# Altium project bionik_wstep.PrjPcb
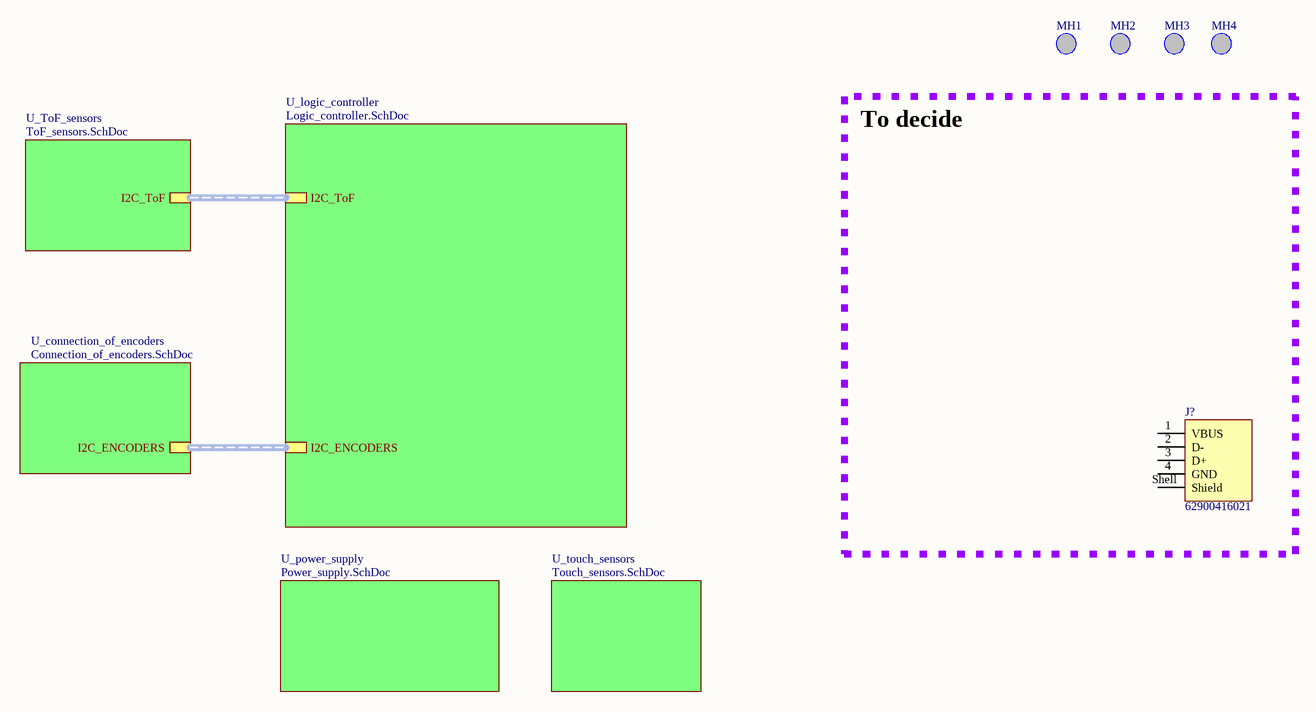
[diagram p0: Schield_elkapod.SchDoc]
6 sheets, 119 parts. Net scope: hierarchical (ports join the sheet entries above them; power ports are global).
Board file: PCB1.PcbDoc
Sheets:
  Schield_elkapod.SchDoc
    U_logic_controller = Logic_controller.SchDoc
    U_connection_of_encoders = Connection_of_encoders.SchDoc
    U_power_supply = Power_supply.SchDoc
    U_ToF_sensors = ToF_sensors.SchDoc
    U_touch_sensors = Touch_sensors.SchDoc

## Sheet Schield_elkapod.SchDoc
size A4; SheetNumber: 1; SheetTotal: 6

### Parts
(Parts that share a designator on the sheet are numbered #1, #2 ... from top to bottom, then left to right.)
J?#1  62900416021  [62900416021]
MH1  mounting hole  [MH?]  (value not drawn)
MH2  mounting hole  [MH?]  (value not drawn)
MH3  mounting hole  [MH?]  (value not drawn)
MH4  mounting hole  [MH?]  (value not drawn)

### Blocks framed on the sheet
To decide: J?#1

### Sub-sheets
U_connection_of_encoders = Connection_of_encoders.SchDoc: I2C_ENCODERS (harness I2C_MULTIPLEXERS)
U_logic_controller = Logic_controller.SchDoc: I2C_ENCODERS (harness I2C_MULTIPLEXERS), I2C_ToF
U_power_supply = Power_supply.SchDoc: no entries
U_ToF_sensors = ToF_sensors.SchDoc: I2C_ToF
U_touch_sensors = Touch_sensors.SchDoc: no entries

### Nets

Not connected (* = marked no-connect by the designer): J?#1 1(VBUS) 2(D-) 3(D+) 4(GND) Shell(Shield)

### Buses and harness runs
harness sheet U_connection_of_encoders/I2C_ENCODERS = sheet U_logic_controller/I2C_ENCODERS
harness sheet U_logic_controller/I2C_ToF = sheet U_ToF_sensors/I2C_ToF

### Library data of the parts
J?#1 = CMP-1502-03240-2: NexarPartId: 19991170; Number of Contacts: 4; Insulation Resistance: 1GΩ; Connector Type: USB; Contact Resistance: 20mΩ; Gender: Receptacle; Current Rating: 1.5A; Operating Supply Voltage: 30V; USB Standard: USB 2.0; Packaging: Cut Tape; Contact Plating: Gold; REACH SVHC: Unknown; Orientation: Horizontal; RoHS: Compliant; Features: Shielded; Length: 14.4mm; Max Operating Temperature: 105°C; Number of Pins: 4; Termination: SMD/SMT; Lead Free: Lead Free; Min Operating Temperature: -40°C; Mount: Horizontal, Surface Mount
MH1 = CMP-00030-00006-7: mounting hole 3mm padded
MH2 MH4 = CMP-00030-00006-7: Mmounting hole 3mm padded
MH3 = CMP-00030-00006-7: MHmounting hole 3mm padded

## Sheet Logic_controller.SchDoc
size A3; SheetNumber: 2; SheetTotal: 6
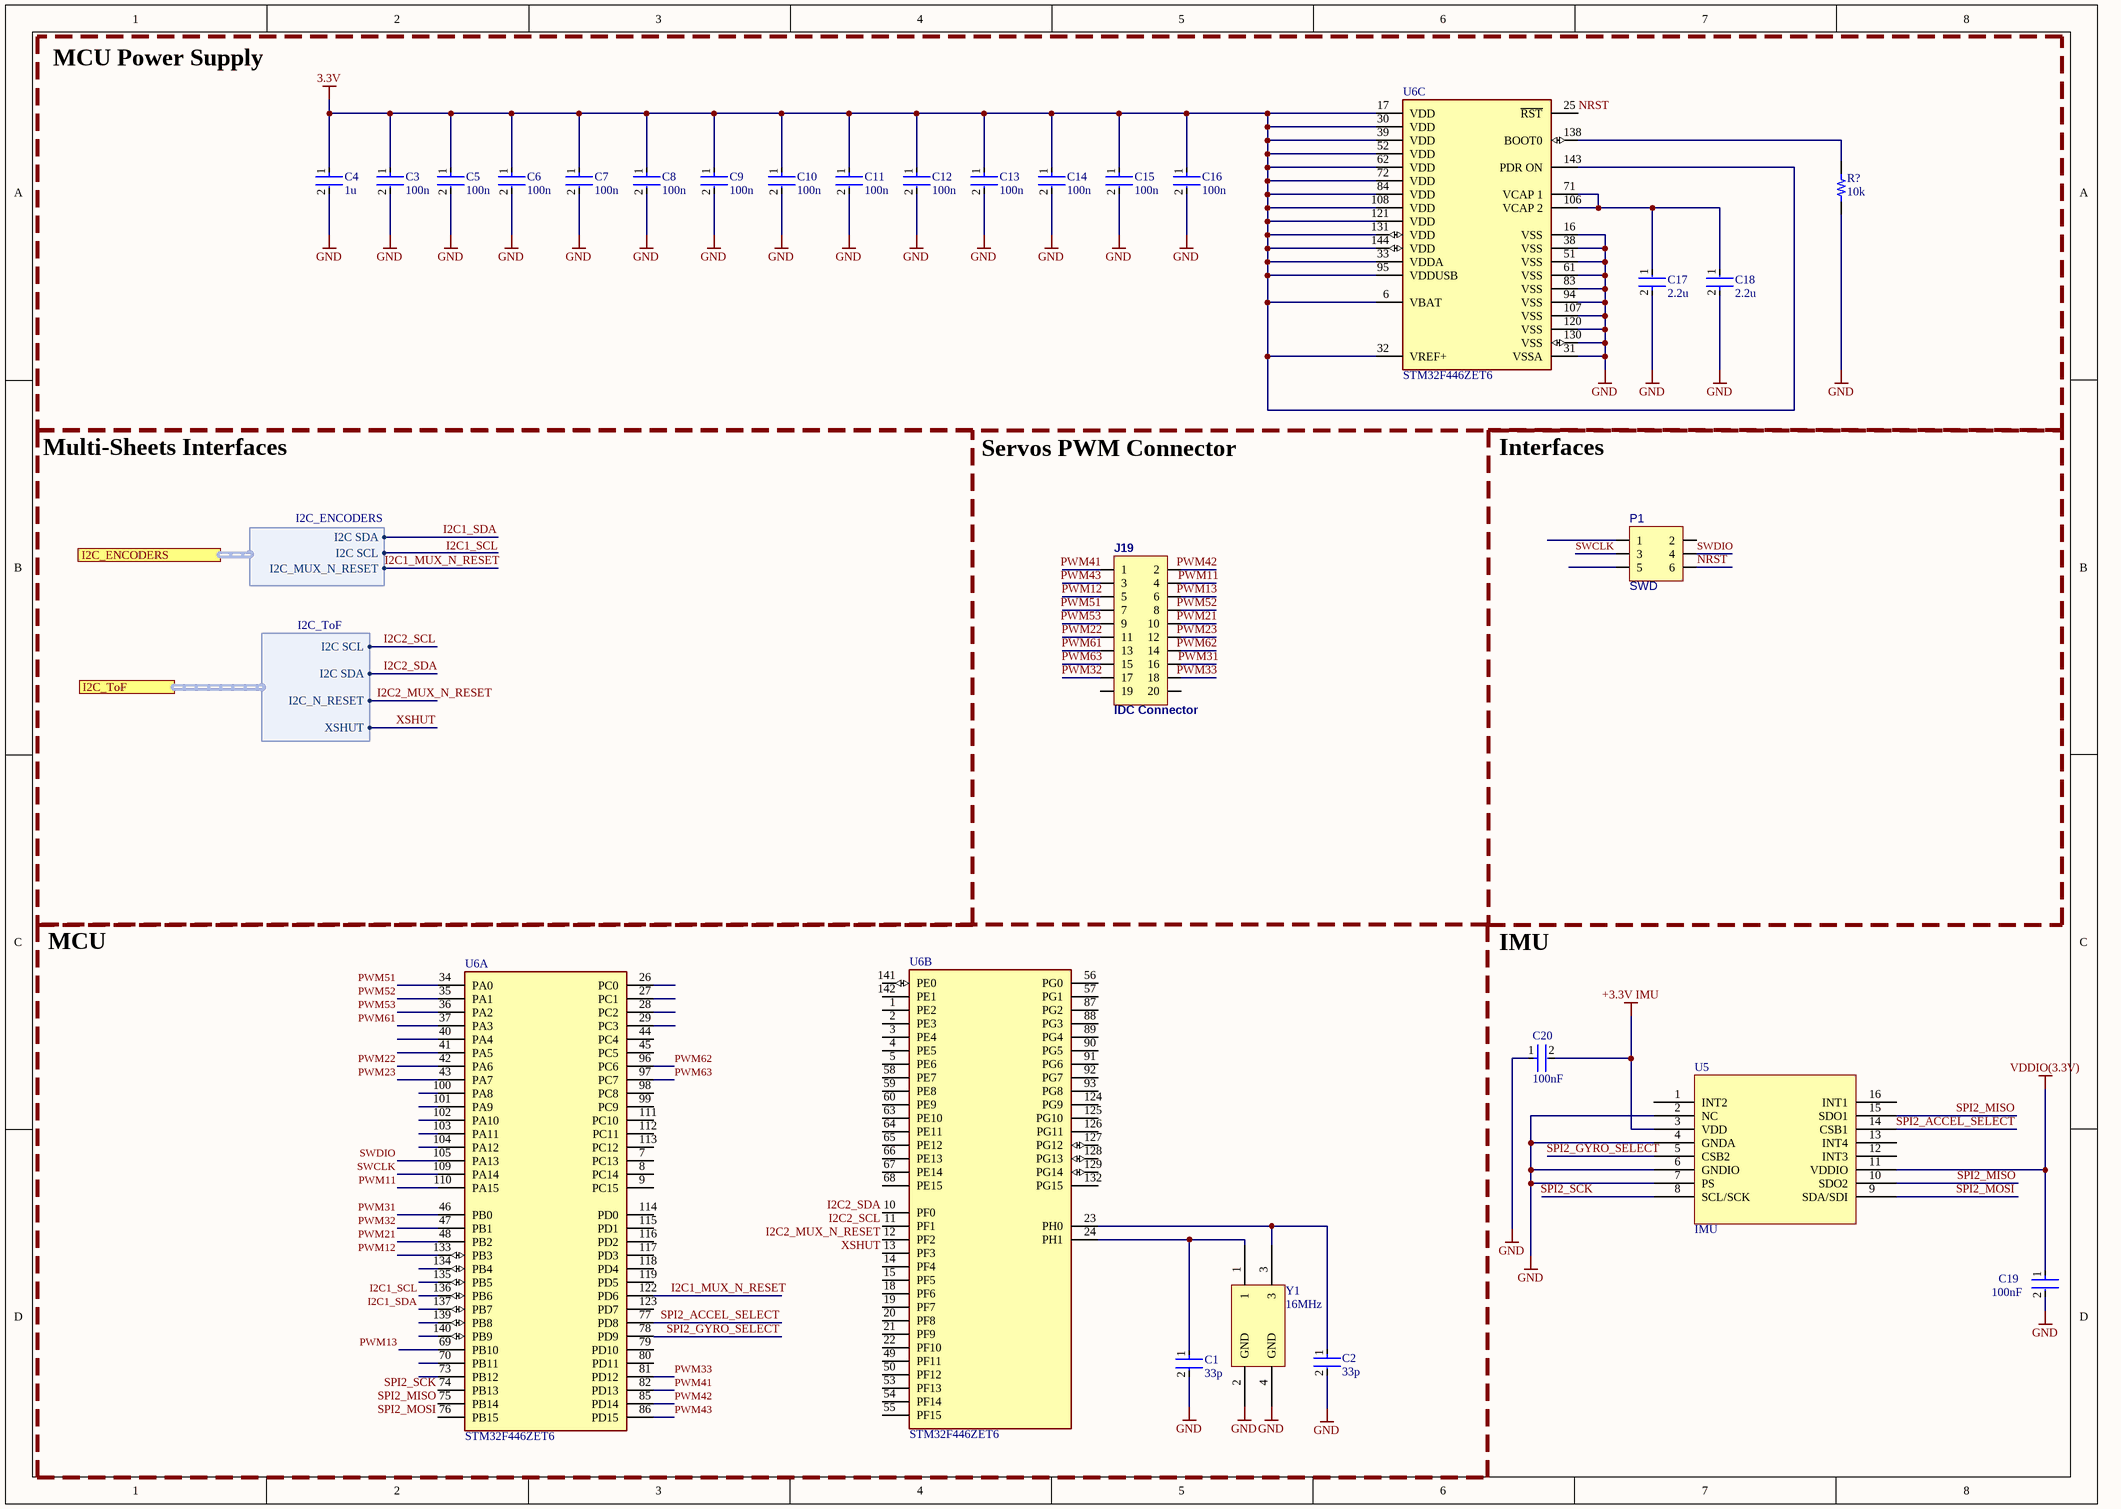
[diagram p1: Logic_controller.SchDoc]

### Parts
C1  33p  [FP-C0603C-CF-MFG]
C2  33p  [FP-C0603C-CF-MFG]
C3  100n  [FP-C0603C-CF-MFG]
C4  1u  [FP-C0603C-CF-MFG]
C5  100n  [FP-C0603C-CF-MFG]
C6  100n  [FP-C0603C-CF-MFG]
C7  100n  [FP-C0603C-CF-MFG]
C8  100n  [FP-C0603C-CF-MFG]
C9  100n  [FP-C0603C-CF-MFG]
C10  100n  [FP-C0603C-CF-MFG]
C11  100n  [FP-C0603C-CF-MFG]
C12  100n  [FP-C0603C-CF-MFG]
C13  100n  [FP-C0603C-CF-MFG]
C14  100n  [FP-C0603C-CF-MFG]
C15  100n  [FP-C0603C-CF-MFG]
C16  100n  [FP-C0603C-CF-MFG]
C17  2.2u  [FP-C1608-080-0_1-MFG]
C18  2.2u  [FP-C1608-080-0_1-MFG]
C19  100nF  [FP-CC0603-DA-MFG]
C20  100nF  [FP-CC0603-DA-MFG]
J19  IDC Connector  [IDC20]
P1  SWD  [GP_3x2]
R?  10k  [RES 0603_1608]
U5  IMU  [BMI088-Footprint-1]
U6  STM32F446ZET6  [FP-STM32F446ZET6-IPC_C]  (parts A,B,C of 3)
Y1  16MHz  [New footprint 1]

### Blocks framed on the sheet
MCU Power Supply: C3-C18 R? U6
Interfaces: P1
MCU: C1 C2 U6 Y1

### Ports
I2C_ENCODERS (harness I2C_ENCODERS, see Schield_elkapod[2B], Connection_of_encoders[1A]), I2C_ToF (harness I2C_ToF, see Schield_elkapod[2A], ToF_sensors[1A])

### Harnesses
I2C_ENCODERS: I2C SDA, I2C SCL, I2C_MUX_N_RESET
I2C_ToF: I2C SCL, I2C SDA, I2C_N_RESET, XSHUT

### Nets
3.3V: C3.1 C4.1 C5.1 C6.1 C7.1 C8.1 C9.1 C10.1 C11.1 C12.1 C13.1 C14.1 C15.1 C16.1 U6.6(VBAT) U6.17(VDD) U6.30(VDD) U6.32(VREF+) U6.33(VDDA) U6.39(VDD) U6.52(VDD) U6.62(VDD) U6.72(VDD) U6.84(VDD) U6.95(VDDUSB) U6.108(VDD) U6.121(VDD) U6.131(VDD) U6.143(PDR_ON) U6.144(VDD)
+3.3V IMU: C20.2 U5.3(VDD)
GND: C1.2 C2.2 C3.2 C4.2 C5.2 C6.2 C7.2 C8.2 C9.2 C10.2 C11.2 C12.2 C13.2 C14.2 C15.2 C16.2 C17.2 C18.2 C19.2 C20.1 R?.2 U5.2(NC) U5.4(GNDA) U5.6(GNDIO) U5.7(PS) U6.16(VSS) U6.31(VSSA) U6.38(VSS) U6.51(VSS) U6.61(VSS) U6.83(VSS) U6.94(VSS) U6.107(VSS) U6.120(VSS) U6.130(VSS) Y1.2(GND) Y1.4(GND)
VDDIO(3.3V): C19.1 U5.11(VDDIO)
I2C1_MUX_N_RESET: U6.122(PD6) ; port I2C_ENCODERS.I2C_MUX_N_RESET
I2C1_SCL: U6.136(PB6) ; port I2C_ENCODERS.I2C SCL
I2C1_SDA: U6.137(PB7) ; port I2C_ENCODERS.I2C SDA
I2C2_MUX_N_RESET: U6.12(PF2) ; port I2C_ToF.I2C_N_RESET
I2C2_SCL: U6.11(PF1) ; port I2C_ToF.I2C SCL
I2C2_SDA: U6.10(PF0) ; port I2C_ToF.I2C SDA
NRST: P1.6 U6.25(~{RST})
PWM11: J19.4 U6.110(PA15)
PWM12: J19.5 U6.133(PB3)
PWM13: J19.6 U6.69(PB10)
PWM21: J19.10 U6.48(PB2)
PWM22: J19.11 U6.42(PA6)
PWM23: J19.12 U6.43(PA7)
PWM31: J19.16 U6.46(PB0)
PWM32: J19.17 U6.47(PB1)
PWM33: J19.18 U6.81(PD12)
PWM41: J19.1 U6.82(PD13)
PWM42: J19.2 U6.85(PD14)
PWM43: J19.3 U6.86(PD15)
PWM51: J19.7 U6.34(PA0)
PWM52: J19.8 U6.35(PA1)
PWM53: J19.9 U6.36(PA2)
PWM61: J19.13 U6.37(PA3)
PWM62: J19.14 U6.96(PC6)
PWM63: J19.15 U6.97(PC7)
SPI2_ACCEL_SELECT: U5.14(CSB1) U6.77(PD8)
SPI2_GYRO_SELECT: U5.5(CSB2) U6.78(PD9)
SPI2_MISO: U5.10(SDO2) U5.15(SDO1) U6.75(PB14)
SPI2_MOSI: U5.9(SDA/SDI) U6.76(PB15)
SPI2_SCK: U5.8(SCL/SCK) U6.74(PB13)
SWCLK: P1.3 U6.109(PA14)
SWDIO: P1.4 U6.105(PA13)
XSHUT: U6.13(PF3) ; port I2C_ToF.XSHUT
NetC1_1: C1.1 U6.24(PH1) Y1.1
NetC2_1: C2.1 U6.23(PH0) Y1.3
NetC17_1: C17.1 C18.1 U6.71(VCAP_1) U6.106(VCAP_2)
NetR?_1: R?.1 U6.138(BOOT0)

Not connected (* = marked no-connect by the designer): J19 19 20; P1 1 2 5; U5 1(INT2) 12(INT3) 13(INT4) 16(INT1); U6 1(PE2) 2(PE3) 3(PE4) 4(PE5) 5(PE6) 7(PC13) 8(PC14) 9(PC15) 14(PF4) 15(PF5) 18(PF6) 19(PF7) 20(PF8) 21(PF9) 22(PF10) 26(PC0) 27(PC1) 28(PC2) 29(PC3) 40(PA4) 41(PA5) 44(PC4) 45(PC5) 49(PF11) 50(PF12) 53(PF13) 54(PF14) 55(PF15) 56(PG0) 57(PG1) 58(PE7) 59(PE8) 60(PE9) 63(PE10) 64(PE11) 65(PE12) 66(PE13) 67(PE14) 68(PE15) 70(PB11) 73(PB12) 79(PD10) 80(PD11) 87(PG2) 88(PG3) 89(PG4) 90(PG5) 91(PG6) 92(PG7) 93(PG8) 98(PC8) 99(PC9) 100(PA8) 101(PA9) 102(PA10) 103(PA11) 104(PA12) 111(PC10) 112(PC11) 113(PC12) 114(PD0) 115(PD1) 116(PD2) 117(PD3) 118(PD4) 119(PD5) 123(PD7) 124(PG9) 125(PG10) 126(PG11) 127(PG12) 128(PG13) 129(PG14) 132(PG15) 134(PB4) 135(PB5) 139(PB8) 140(PB9) 141(PE0) 142(PE1)

### Notes on the sheet
- Multi-Sheets Interfaces
- Servos PWM Connector
- IMU

### Library data of the parts
C1 C2 = CMP-03020-030291-1: Cap Ceramic 0.0027uF 25V C0G 1% SMD 0603 125°C Paper T/R; Manufacturer: KEMET; Manufacturer Part Number: C0603C272F3GAC7867; Automotive Grade: Grade 1; Tolerance: 0.01; Value: 2,700 pF; Temperature Coefficient: 30ppm/°C; Material: Ceramic; Device Class L2: Capacitors; Device Class L3: Ceramic Capacitors; ComponentLink2Description: Datasheet; Category: Cap; Automotive: Yes; Octopart: https://octopart.com/c0603c272f3gac7867-kemet-90390867; Temperature Range High: +125°C; Package: C0603C-CF; Device Class L1: Passive Components; Digikey Description: Cap Ceramic 0.0027uF 25V C0G 1% SMD 0603 125°C Paper T/R; Temperature Characteristic: C0G; Temperature Range Low: -55°C; Temperature: -55°C to +125°C; Height: 0.87mm; ComponentLink2URL: https://api.kemet.com/component-edge/download/datasheet/C0603C100J5GACAUTO.pdf; Voltage Rating: 25 V; Capacitance: 2,700 pF; Lead Free: Yes; RoHS: TRUE
C3 C5-C16 = CMP-03020-030291-1: CAP CER 100nF 25V X5R 0603 C0603C272F3GAC7867; Manufacturer: KEMET; Material: Ceramic; Automotive Grade: Grade 1; Tolerance: 0.01; Temperature Characteristic: C0G; Value: 2,700 pF; Temperature Coefficient: 30ppm/°C; Device Class L2: Capacitors; Device Class L3: Ceramic Capacitors; ComponentLink2Description: Datasheet; Category: Cap; Automotive: Yes; Octopart: https://octopart.com/c0603c272f3gac7867-kemet-90390867; Temperature Range High: +125°C; Package: C0603C-CF; Device Class L1: Passive Components; Digikey Description: Cap Ceramic 0.0027uF 25V C0G 1% SMD 0603 125°C Paper T/R; Temperature Range Low: -55°C; Temperature: -55°C to +125°C; Height: 0.87mm; ComponentLink2URL: https://api.kemet.com/component-edge/download/datasheet/C0603C100J5GACAUTO.pdf; Voltage Rating: 25 V; Capacitance: 2,700 pF; Lead Free: Yes; Manufacturer Part Number: C0603C272F3GAC7867; RoHS: TRUE
C4 = CMP-03020-030291-1: CAP CER 1uF 16V X5R 0603 C0603C272F3GAC7867; Manufacturer: KEMET; Material: Ceramic; Automotive Grade: Grade 1; Tolerance: 0.01; Temperature Characteristic: C0G; Value: 2,700 pF; Voltage Rating: 25 V; Temperature Coefficient: 30ppm/°C; Device Class L2: Capacitors; Device Class L3: Ceramic Capacitors; ComponentLink2Description: Datasheet; Category: Cap; Automotive: Yes; Octopart: https://octopart.com/c0603c272f3gac7867-kemet-90390867; Temperature Range High: +125°C; Package: C0603C-CF; Device Class L1: Passive Components; Digikey Description: Cap Ceramic 0.0027uF 25V C0G 1% SMD 0603 125°C Paper T/R; Temperature Range Low: -55°C; Temperature: -55°C to +125°C; Height: 0.87mm; ComponentLink2URL: https://api.kemet.com/component-edge/download/datasheet/C0603C100J5GACAUTO.pdf; Capacitance: 2,700 pF; Lead Free: Yes; Manufacturer Part Number: C0603C272F3GAC7867; RoHS: TRUE
C17 C18 = CMP-08246-003049-1: Multilayer Ceramic Capacitors 2.2μF ±10% 25V X5R SMD 0603 C1608X5R1E225K080AB; Capacitance: 2.2uF; Termination: SMD/SMT; Dielectric Material: Ceramic; REACH SVHC: No SVHC; Voltage Rating (DC): 25V; Voltage Rating: 25V; RoHS Compliant: Yes; Case Code (Imperial): 0603; Case/Package: 0603; Height: 0.8mm; Mount: Surface Mount; Min Operating Temperature: -55°C; Tolerance: 10%; Radiation Hardening: No; Dielectric: X5R; Depth: 0.8mm; Package Quantity: 4000; Length: 1.6mm; Weight: 7.1E-05oz; Resistor Type: Ceramic; Series: C; Thickness: 0.035inch; Width: 0.031inch; Case Code (Metric): 1608; Lead Free: Lead Free; Max Operating Temperature: 85°C; Packaging: Tape and Reel
C19 C20 = CMP-2100-03601-2: CAP CER 0.1UF 50V X7R 0603 CC0603KRX7R9BB104; Manufacturer: YAGEO; Material: Ceramic; Temperature Coefficient: 15%; Tolerance: 0.1; Height: 0.9mm; Voltage: 50 V; ComponentLink2Description: Datasheet; Device Class L2: Capacitors; Temperature Range High: +125°C; Category: Cap; Capacitance: 100 nF; Footprint Url: http://www.yageo.com/exep/pages/download/literatures/UPY-C_GEN_24.pdf; ComponentLink2URL: http://www.yageo.com/documents/recent/UPY-GPHC_X7R_6.3V-to-50V_18.pdf; Package: CC0603-DA; Temperature: -55°C to +125°C; Voltage Rating: 50 V; Temperature Characteristic: X7R; Device Class L1: Passive Components; Temperature Range Low: -55°C; Manufacturer Part Number: CC0603KRX7R9BB104; RoHS: TRUE; Automotive: No; Value: 100 nF; Device Class L3: Ceramic Capacitors; Octopart: https://octopart.com/cc0603krx7r9bb104-yageo-42244635; Mouser Description: Multilayer Ceramic Capacitor, CC Series, 0.1 - F, - 10%, X7R, 50 V, 0603 [1608 Metric]; Lead Free: Yes; Digikey Description: CAP CER 0.1UF 50V X7R 0603
J19 = CN_10x2
P1 = CN_3x2
R? = RNCS0603BKE10K0: RES 10K OHM 1% 0,1W 0603; Manufacturer: Stackpole Electronics Inc; Power (Watts): 0.063W, 1/16W; Temperature Coefficient: ±25ppm/°C; Tolerance: ±0.1%; Part Number: RNCS0603BKE10K0; Value: 10k; Composition: Thin Film; Device Package: 0603 (1608 Metric); Features: Anti-Corrosive, Automotive AEC-Q200, Moisture Resistant; Height - Seated (Max): 0.022" (0.55mm); LastUpdated: 09.02.2024 20:43:37; Lifecycle Status: Active; Minimum Order: 1; Number of Terminations: 2; Operating Temperature: -55°C ~ 155°C; Package / Case: 0603 (1608 Metric); Packaging: TapeAndReel; PartId: 4838; Part Status: Active; Price: 0.06; Ratings: AEC-Q200; Resistance: 10k; Series: RNCS; Size / Dimension: 0.061" L x 0.031" W (1.55mm x 0.80mm); Supplier Device Package: 0603
U5 = CMP-00030-00005-6: BMI088 Series 3.6 V 6 Axis Digital Output Accelerometer Motion Sensor - LGA-16
U6 = CMP-12105-000067-1: IC MCU 32BIT 512KB FLASH 144LQFP; Manufacturer: STMicroelectronics; Standoff Height: 0.05mm; Memory Size: 512KBytes; Data Bus Width: 32bits; Number Of Timers/Counters: 14; Number Of I2C Channels: 4; Number Of Usb Channels: 2; Frequency: 180MHz; Ram Size: 128KBytes; Number Of I/Os: 114; Min Supply Voltage: 1.7V; Max Junction Temp: +105°C; Number Of Cores: 1; Core Architecture: Arm Cortex-M4; Max Supply Voltage: 3.6V; Number Of Adc Channels: 24; Number Of Pwm Channels: 32; Number Of Uart Channels: 6; Number Of A/D Converters: 3; Interface: I2C,SPI,UART,USART,EBI/EMI,CAN,USB,LIN,IrDA,I2S,SMBus,Other; Mouser Description: 32 Bit Microcontroller, High Performance, Arm Cortex-M4, 180 Mhz, 512 Kb, 128 Kb, 144, Lqfp; Temperature Range High: +105°C; Device Class L3: Microcontrollers; Ambient Temperature Range High: +85°C; Lead Free: Yes; Octopart: https://octopart.com/stm32f446zet6-stmicroelectronics-52642927; Device Class L2: Embedded Processors and Controllers; Height: 1.6mm; Category: IC; Manufacturer Part Number: STM32F446ZET6; RoHS: TRUE; Memory Type: FLASH; Temperature: -40°C to +105°C; Number Of Spi Channels: 4; Device Class L1: Integrated Circuits (ICs); Package: LQFP144; Digikey Description: IC MCU 32BIT 512KB FLASH 144LQFP; Automotive: No; ComponentLink2Description: Datasheet; ComponentLink2URL: https://www.st.com/content/ccc/resource/technical/document/datasheet/65/cb/75/50/53/d6/48/24/DM00141306.pdf/files/DM00141306.pdf/jcr:content/translations/en.DM00141306.pdf; Ambient Temperature Range Low: -40°C; Temperature Range Low: -40°C
Y1 = CMP-00030-00007-3: resonator 16MHz LFXTAL030819BULK

## Sheet Connection_of_encoders.SchDoc
size A4; SheetNumber: 3; SheetTotal: 6
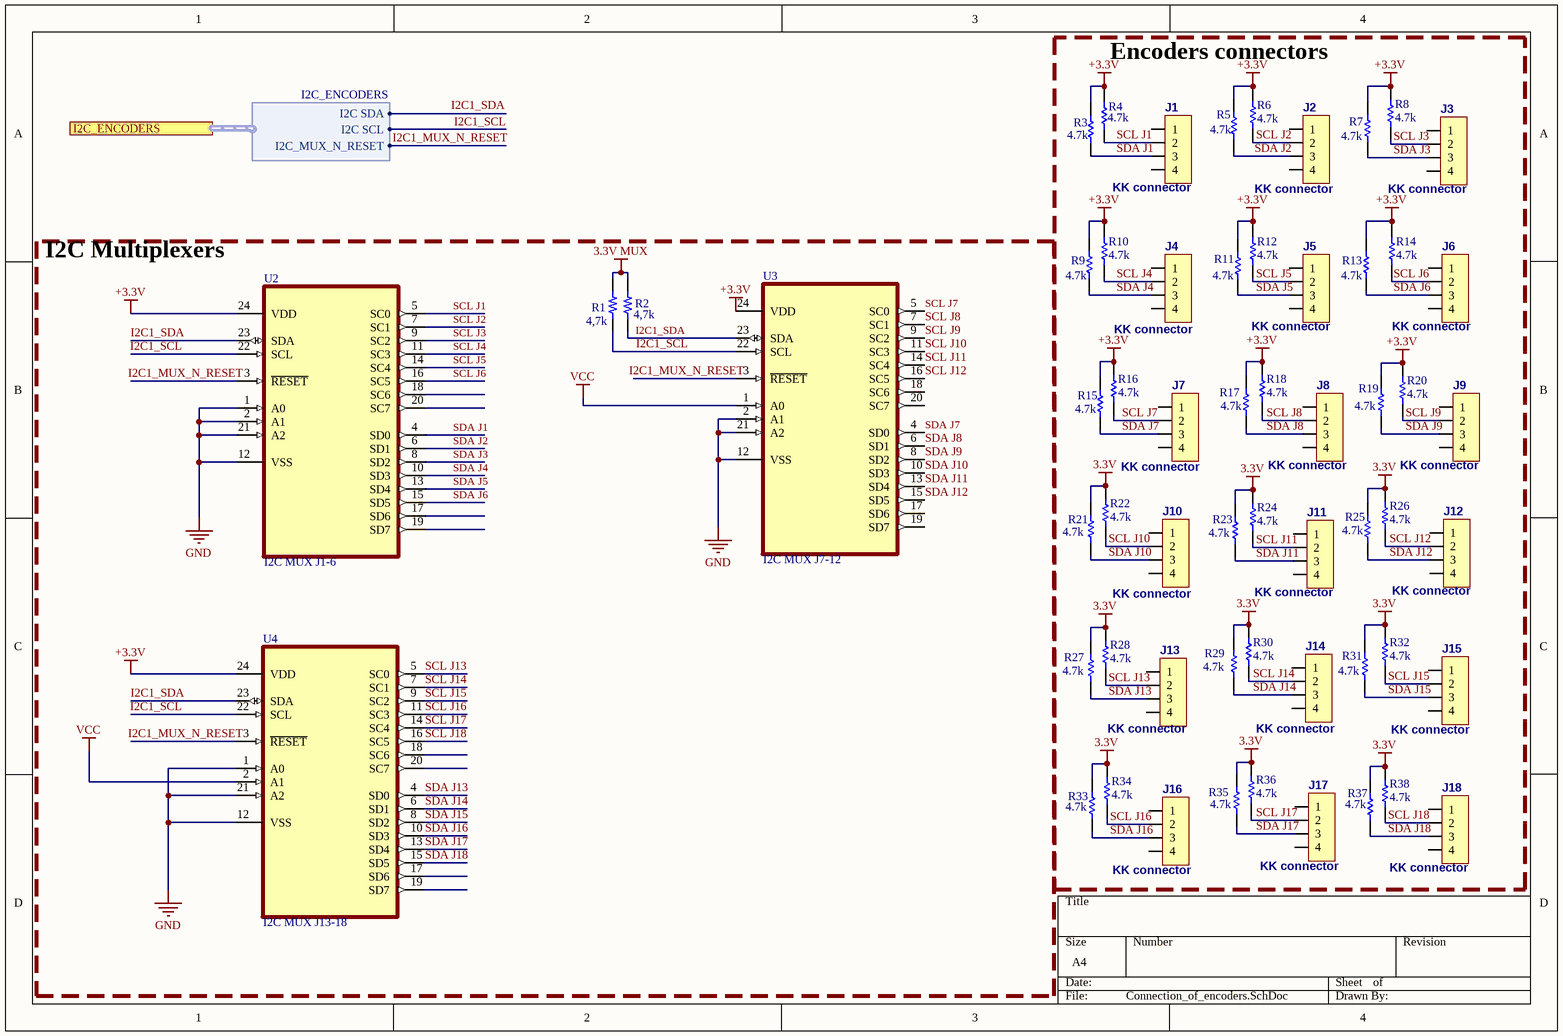
[diagram p2: Connection_of_encoders.SchDoc]

### Parts
J1  KK connector  [KK/2.54/4]
J2  KK connector  [KK/2.54/4]
J3  KK connector  [KK/2.54/4]
J4  KK connector  [KK/2.54/4]
J5  KK connector  [KK/2.54/4]
J6  KK connector  [KK/2.54/4]
J7  KK connector  [KK/2.54/4]
J8  KK connector  [KK/2.54/4]
J9  KK connector  [KK/2.54/4]
J10  KK connector  [KK/2.54/4]
J11  KK connector  [KK/2.54/4]
J12  KK connector  [KK/2.54/4]
J13  KK connector  [KK/2.54/4]
J14  KK connector  [KK/2.54/4]
J15  KK connector  [KK/2.54/4]
J16  KK connector  [KK/2.54/4]
J17  KK connector  [KK/2.54/4]
J18  KK connector  [KK/2.54/4]
R1  4,7k  [RES 0603_1608]
R2  4,7k  [RES 0603_1608]
R3  4.7k  [RESC1609X50X30ML10T20]
R4  4.7k  [RESC1609X50X30ML10T20]
R5  4.7k  [RESC1609X50X30ML10T20]
R6  4.7k  [RESC1609X50X30ML10T20]
R7  4.7k  [RESC1609X50X30ML10T20]
R8  4.7k  [RESC1609X50X30ML10T20]
R9  4.7k  [RESC1609X50X30ML10T20]
R10  4.7k  [RESC1609X50X30ML10T20]
R11  4.7k  [RESC1609X50X30ML10T20]
R12  4.7k  [RESC1609X50X30ML10T20]
R13  4.7k  [RESC1609X50X30ML10T20]
R14  4.7k  [RESC1609X50X30ML10T20]
R15  4.7k  [RESC1609X50X30ML10T20]
R16  4.7k  [RESC1609X50X30ML10T20]
R17  4.7k  [RESC1609X50X30ML10T20]
R18  4.7k  [RESC1609X50X30ML10T20]
R19  4.7k  [RESC1609X50X30ML10T20]
R20  4.7k  [RESC1609X50X30ML10T20]
R21  4.7k  [RESC1609X50X30ML10T20]
R22  4.7k  [RESC1609X50X30ML10T20]
R23  4.7k  [RESC1609X50X30ML10T20]
R24  4.7k  [RESC1609X50X30ML10T20]
R25  4.7k  [RESC1609X50X30ML10T20]
R26  4.7k  [RESC1609X50X30ML10T20]
R27  4.7k  [RESC1609X50X30ML10T20]
R28  4.7k  [RESC1609X50X30ML10T20]
R29  4.7k  [RESC1609X50X30ML10T20]
R30  4.7k  [RESC1609X50X30ML10T20]
R31  4.7k  [RESC1609X50X30ML10T20]
R32  4.7k  [RESC1609X50X30ML10T20]
R33  4.7k  [RESC1609X50X30ML10T20]
R34  4.7k  [RESC1609X50X30ML10T20]
R35  4.7k  [RESC1609X50X30ML10T20]
R36  4.7k  [RESC1609X50X30ML10T20]
R37  4.7k  [RESC1609X50X30ML10T20]
R38  4.7k  [RESC1609X50X30ML10T20]
U2  I2C MUX J1-6  [SOP65P640X110-24N]
U3  I2C MUX J7-12  [SOP65P640X110-24N]
U4  I2C MUX J13-18  [SOP65P640X110-24N]

### Blocks framed on the sheet
Encoders connectors: J1-J18 R3-R38
I2C Multiplexers: R1 R2 U2-U4

### Ports
I2C_ENCODERS (harness I2C_ENCODERS, see Schield_elkapod[2B], Logic_controller[1B])

### Harnesses
I2C_ENCODERS: I2C SDA, I2C SCL, I2C_MUX_N_RESET

### Nets
3.3V: R21.2 R22.2 R23.2 R24.2 R25.2 R26.2 R27.2 R28.2 R29.2 R30.2 R31.2 R32.2 R33.2 R34.2 R35.2 R36.2 R37.2 R38.2
3.3V MUX: R1.1 R2.1
+3.3V: R3.2 R4.2 R5.2 R6.2 R7.2 R8.2 R9.2 R10.2 R11.2 R12.2 R13.2 R14.2 R15.2 R16.2 R17.2 R18.2 R19.2 R20.2 U2.24(VDD) U3.24(VDD) U4.24(VDD)
GND: U2.1(A0) U2.2(A1) U2.12(VSS) U2.21(A2) U3.2(A1) U3.12(VSS) U3.21(A2) U4.1(A0) U4.12(VSS) U4.21(A2)
VCC: U3.1(A0) U4.2(A1)
I2C1_MUX_N_RESET: U2.3(~{RESET}) U3.3(~{RESET}) U4.3(~{RESET}) ; port I2C_ENCODERS.I2C_MUX_N_RESET
I2C1_SCL: R1.2 U2.22(SCL) U3.22(SCL) U4.22(SCL) ; port I2C_ENCODERS.I2C SCL
I2C1_SDA: R2.2 U2.23(SDA) U3.23(SDA) U4.23(SDA) ; port I2C_ENCODERS.I2C SDA
SCL J1: J1.2 R4.1 U2.5(SC0)
SCL J2: J2.2 R6.1 U2.7(SC1)
SCL J3: J3.2 R8.1 U2.9(SC2)
SCL J4: J4.2 R10.1 U2.11(SC3)
SCL J5: J5.2 R12.1 U2.14(SC4)
SCL J6: J6.2 R14.1 U2.16(SC5)
SCL J7: J7.2 R16.1 U3.5(SC0)
SCL J8: J8.2 R18.1 U3.7(SC1)
SCL J9: J9.2 R20.1 U3.9(SC2)
SCL J10: J10.2 R22.1 U3.11(SC3)
SCL J11: J11.2 R24.1 U3.14(SC4)
SCL J12: J12.2 R26.1 U3.16(SC5)
SCL J13: J13.2 R28.1 U4.5(SC0)
SCL J14: J14.2 R30.1 U4.7(SC1)
SCL J15: J15.2 R32.1 U4.9(SC2)
SCL J16: J16.2 R34.1 U4.11(SC3)
SCL J17: J17.2 R36.1 U4.14(SC4)
SCL J18: J18.2 R38.1 U4.16(SC5)
SDA J1: J1.3 R3.1 U2.4(SD0)
SDA J2: J2.3 R5.1 U2.6(SD1)
SDA J3: J3.3 R7.1 U2.8(SD2)
SDA J4: J4.3 R9.1 U2.10(SD3)
SDA J5: J5.3 R11.1 U2.13(SD4)
SDA J6: J6.3 R13.1 U2.15(SD5)
SDA J7: J7.3 R15.1 U3.4(SD0)
SDA J8: J8.3 R17.1 U3.6(SD1)
SDA J9: J9.3 R19.1 U3.8(SD2)
SDA J10: J10.3 R21.1 U3.10(SD3)
SDA J11: J11.3 R23.1 U3.13(SD4)
SDA J12: J12.3 R25.1 U3.15(SD5)
SDA J13: J13.3 R27.1 U4.4(SD0)
SDA J14: J14.3 R29.1 U4.6(SD1)
SDA J15: J15.3 R31.1 U4.8(SD2)
SDA J16: J16.3 R33.1 U4.10(SD3)
SDA J17: J17.3 R35.1 U4.13(SD4)
SDA J18: J18.3 R37.1 U4.15(SD5)

Not connected (* = marked no-connect by the designer): J1 1 4; J2 1 4; J3 1 4; J4 1 4; J5 1 4; J6 1 4; J7 1 4; J8 1 4; J9 1 4; J10 1 4; J11 1 4; J12 1 4; J13 1 4; J14 1 4; J15 1 4; J16 1 4; J17 1 4; J18 1 4; U2 17(SD6) 18(SC6) 19(SD7) 20(SC7); U3 17(SD6) 18(SC6) 19(SD7) 20(SC7); U4 17(SD6) 18(SC6) 19(SD7) 20(SC7)

### Library data of the parts
J1-J18 = CN_4x1: Connector: PCB-cable; KK; socket; male; PIN:4; straight/right-angle; tinned; THT
R1 R2 = RNCS0603BKE10K0: RES 4,7K OHM 1% 0,1W 0603; Manufacturer: Stackpole Electronics Inc; Power (Watts): 0.063W, 1/16W; Temperature Coefficient: ±25ppm/°C; Tolerance: ±0.1%; Part Number: RNCS0603BKE10K0; Value: 4,7k; Composition: Thin Film; Device Package: 0603 (1608 Metric); Features: Anti-Corrosive, Automotive AEC-Q200, Moisture Resistant; Height - Seated (Max): 0.022" (0.55mm); LastUpdated: 09.02.2024 20:43:37; Lifecycle Status: Active; Minimum Order: 1; Number of Terminations: 2; Operating Temperature: -55°C ~ 155°C; Package / Case: 0603 (1608 Metric); Packaging: TapeAndReel; PartId: 4838; Part Status: Active; Price: 0.06; Ratings: AEC-Q200; Resistance: 4,7k; Series: RNCS; Size / Dimension: 0.061" L x 0.031" W (1.55mm x 0.80mm); Supplier Device Package: 0603
R3-R38 = CMP-2000-03860-1: RES 4,7K OHM 1% 0,1W 0603 RNCS0603BKE10K0; Part Number: CRCW060311K0FKEA; Manufacturer: Vishay Dale
U2 U3 = CMP-020-000000-2: Translating Multiplexer Interface 24-TSSOP PCA9547PW,118; MF: NXP USA; Component Type: Standard; Availability: Unavailable; Pin Count: 24; Package: TSSOP-24 NXP Semiconductors; Source: SnapEDAsch.SchLib; Price: None; SnapEDA_Link: https://www.snapeda.com/parts/PCA9547PW,118/NXP%20USA%20Inc./view-part/571417/?ref=snap; Design Item ID: PCA9547PW,118; MP: PCA9547PW,118; Value: *
U4 = CMP-020-000000-2: Translating Multiplexer Interface 24-TSSOP PCA9547PW; MF: NXP USA; Component Type: Standard; Availability: Unavailable; Pin Count: 24; Package: TSSOP-24 NXP Semiconductors; Source: SnapEDAsch.SchLib; Price: None; SnapEDA_Link: https://www.snapeda.com/parts/PCA9547PW,118/NXP%20USA%20Inc./view-part/571417/?ref=snap; Design Item ID: PCA9547PW,118; MP: PCA9547PW,118; Value: *

## Sheet Power_supply.SchDoc
size A4; SheetNumber: 4; SheetTotal: 6
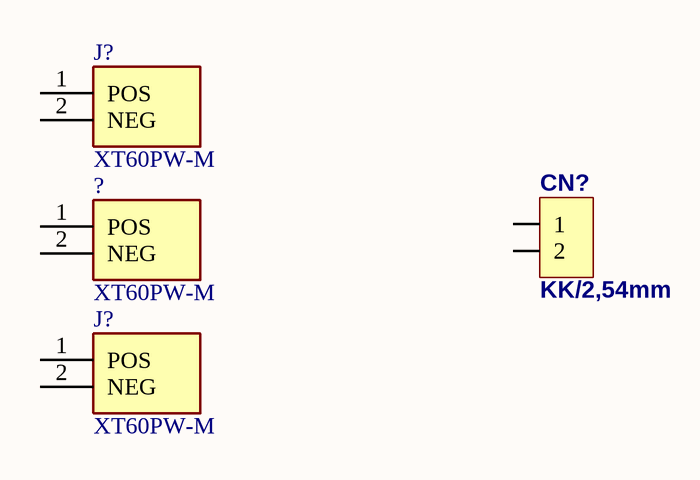
[diagram p3: Power_supply.SchDoc]

### Parts
(Parts that share a designator on the sheet are numbered #1, #2 ... from top to bottom, then left to right.)
?  XT60PW-M  [AMASS_XT60PW-M]
CN?#1  KK/2,54mm  [KK/2.54/2]
J?#2  XT60PW-M  [AMASS_XT60PW-M]
J?#3  XT60PW-M  [AMASS_XT60PW-M]

### Nets

Not connected (* = marked no-connect by the designer): ? 1(POS) 2(NEG); CN?#1 1 2; J?#2 1(POS) 2(NEG); J?#3 1(POS) 2(NEG)

### Library data of the parts
? J?#2 J?#3 = XT60PW-M: Socket, DC supply, male, PIN: 2; MF: AMASS; Check_prices: https://www.snapeda.com/parts/XT60PW-M/AMASS/view-part/?ref=eda; SnapEDA_Link: https://www.snapeda.com/parts/XT60PW-M/AMASS/view-part/?ref=snap; Price: None; Availability: Not in stock; Package: Package; MP: XT60PW-M; Value: *
CN?#1 = CN_2x1: Connector: PCB-cable; KK; socket; male; PIN:2; straight/right-angle; tinned; THT

## Sheet ToF_sensors.SchDoc
size A4; SheetNumber: 5; SheetTotal: 6
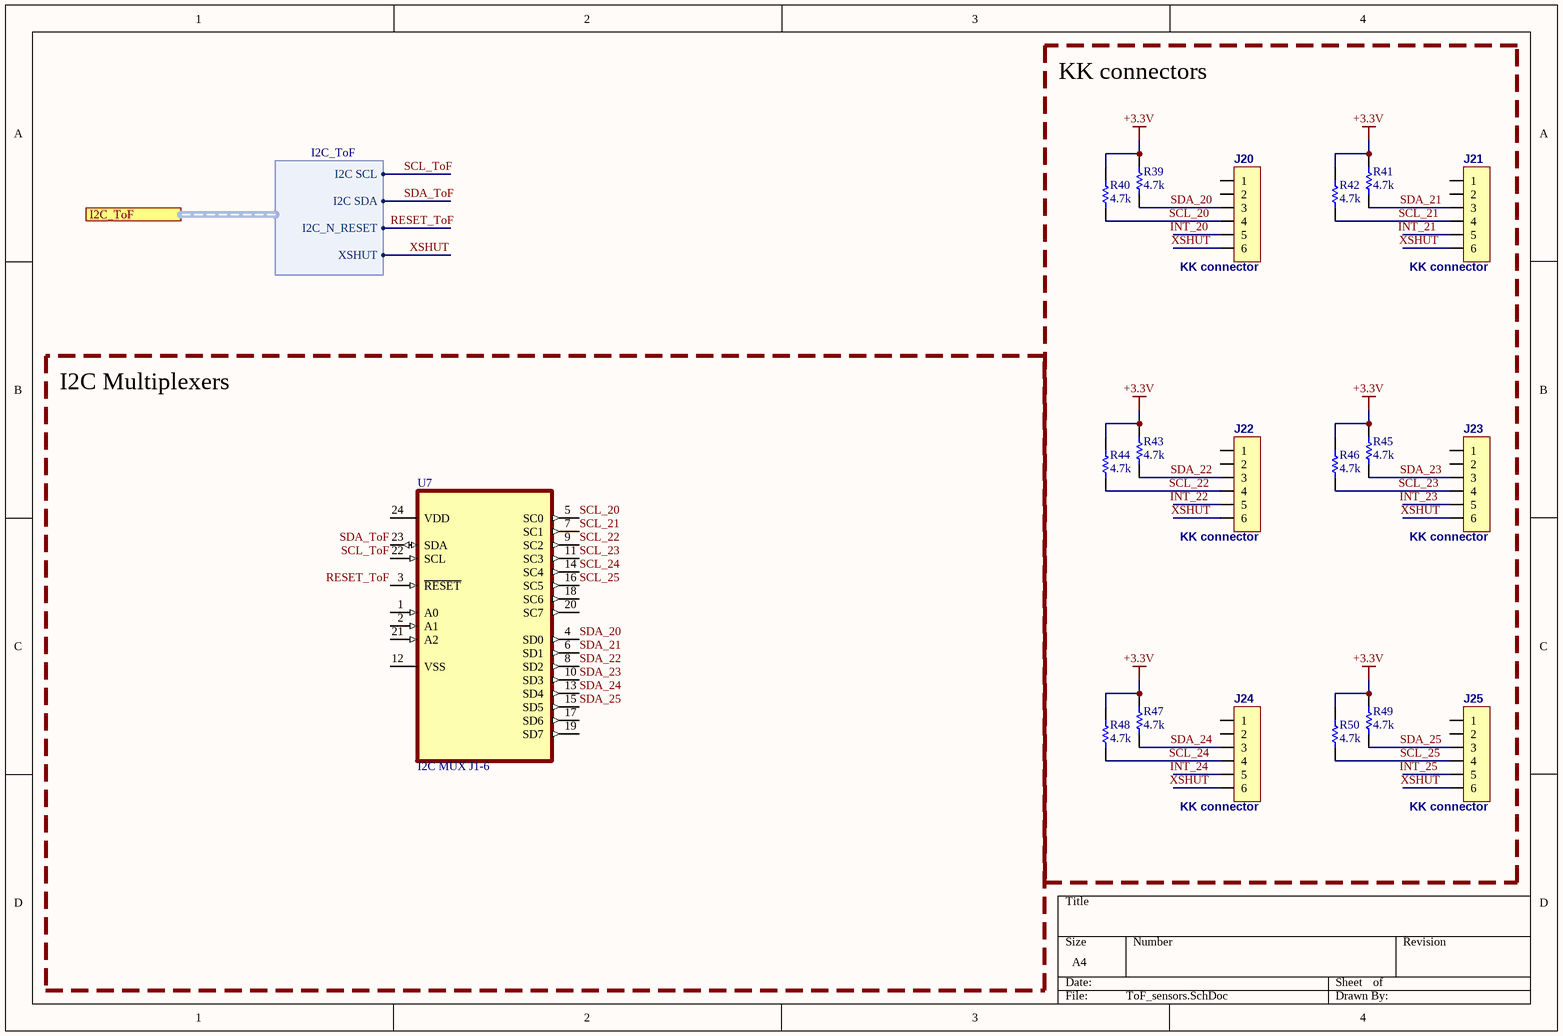
[diagram p4: ToF_sensors.SchDoc]

### Parts
J20  KK connector  [KK/2.54/6]
J21  KK connector  [KK/2.54/6]
J22  KK connector  [KK/2.54/6]
J23  KK connector  [KK/2.54/6]
J24  KK connector  [KK/2.54/6]
J25  KK connector  [KK/2.54/6]
R39  4.7k  [RESC1609X50X30ML10T20]
R40  4.7k  [RESC1609X50X30ML10T20]
R41  4.7k  [RESC1609X50X30ML10T20]
R42  4.7k  [RESC1609X50X30ML10T20]
R43  4.7k  [RESC1609X50X30ML10T20]
R44  4.7k  [RESC1609X50X30ML10T20]
R45  4.7k  [RESC1609X50X30ML10T20]
R46  4.7k  [RESC1609X50X30ML10T20]
R47  4.7k  [RESC1609X50X30ML10T20]
R48  4.7k  [RESC1609X50X30ML10T20]
R49  4.7k  [RESC1609X50X30ML10T20]
R50  4.7k  [RESC1609X50X30ML10T20]
U7  I2C MUX J1-6  [SOP65P640X110-24N]

### Blocks framed on the sheet
KK connectors: J20-J25 R39-R50
I2C Multiplexers: U7

### Ports
I2C_ToF (harness I2C_ToF, see Schield_elkapod[2A], Logic_controller[1B])

### Harnesses
I2C_ToF: I2C SCL, I2C SDA, I2C_N_RESET, XSHUT

### Nets
+3.3V: R39.2 R40.2 R41.2 R42.2 R43.2 R44.2 R45.2 R46.2 R47.2 R48.2 R49.2 R50.2
INT_20: J20.5
INT_21: J21.5
INT_22: J22.5
INT_23: J23.5
INT_24: J24.5
INT_25: J25.5
RESET_ToF: U7.3(~{RESET}) ; port I2C_ToF.I2C_N_RESET  [project net I2C2_MUX_N_RESET]
SCL_20: J20.4 R40.1 U7.5(SC0)
SCL_21: J21.4 R42.1 U7.7(SC1)
SCL_22: J22.4 R44.1 U7.9(SC2)
SCL_23: J23.4 R46.1 U7.11(SC3)
SCL_24: J24.4 R48.1 U7.14(SC4)
SCL_25: J25.4 R50.1 U7.16(SC5)
SCL_ToF: U7.22(SCL) ; port I2C_ToF.I2C SCL  [project net I2C2_SCL]
SDA_20: J20.3 R39.1 U7.4(SD0)
SDA_21: J21.3 R41.1 U7.6(SD1)
SDA_22: J22.3 R43.1 U7.8(SD2)
SDA_23: J23.3 R45.1 U7.10(SD3)
SDA_24: J24.3 R47.1 U7.13(SD4)
SDA_25: J25.3 R49.1 U7.15(SD5)
SDA_ToF: U7.23(SDA) ; port I2C_ToF.I2C SDA  [project net I2C2_SDA]
XSHUT: J20.6 J21.6 J22.6 J23.6 J24.6 J25.6 ; port I2C_ToF.XSHUT

Not connected (* = marked no-connect by the designer): J20 1 2; J21 1 2; J22 1 2; J23 1 2; J24 1 2; J25 1 2; U7 1(A0) 2(A1) 12(VSS) 17(SD6) 18(SC6) 19(SD7) 20(SC7) 21(A2) 24(VDD)

### Library data of the parts
J20-J25 = CN_6x1: Connector: PCB-cable; KK; socket; male; PIN:6; straight/right-angle; tinned; THT, KK/2,54mm
R39-R50 = CMP-2000-03860-1: as R3 on sheet Connection_of_encoders
U7 = CMP-020-000000-2: as U2 on sheet Connection_of_encoders; Component Type: Standard; Availability: Unavailable; Pin Count: 24; Package: TSSOP-24 NXP Semiconductors; Source: SnapEDAsch.SchLib; Price: None; SnapEDA_Link: https://www.snapeda.com/parts/PCA9547PW,118/NXP%20USA%20Inc./view-part/571417/?ref=snap; Design Item ID: PCA9547PW,118; MP: PCA9547PW,118; Value: *

## Sheet Touch_sensors.SchDoc
size A4; SheetNumber: 6; SheetTotal: 6
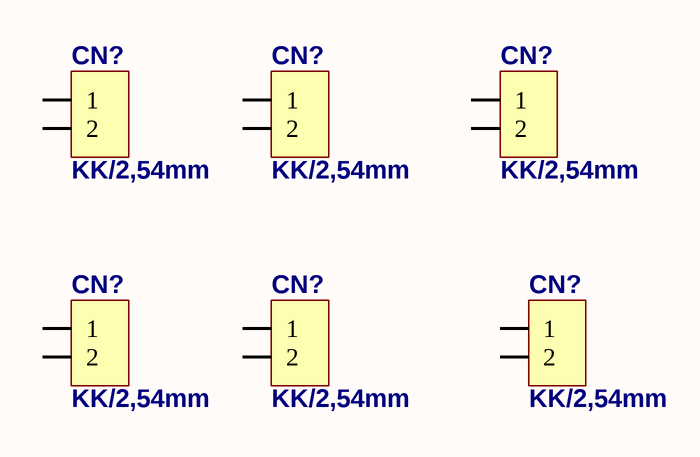
[diagram p5: Touch_sensors.SchDoc]

### Parts
(Parts that share a designator on the sheet are numbered #1, #2 ... from top to bottom, then left to right.)
CN?#2  KK/2,54mm  [KK/2.54/2]
CN?#3  KK/2,54mm  [KK/2.54/2]
CN?#4  KK/2,54mm  [KK/2.54/2]
CN?#5  KK/2,54mm  [KK/2.54/2]
CN?#6  KK/2,54mm  [KK/2.54/2]
CN?#7  KK/2,54mm  [KK/2.54/2]

### Nets

Not connected (* = marked no-connect by the designer): CN?#2 1 2; CN?#3 1 2; CN?#4 1 2; CN?#5 1 2; CN?#6 1 2; CN?#7 1 2

### Library data of the parts
CN?#2-CN?#7 = CN_2x1: as CN?#1 on sheet Power_supply

## Nets that join several sheets
3.3V: Logic_controller (30 pins), Connection_of_encoders (18 pins)
+3.3V: Connection_of_encoders (21 pins), ToF_sensors (12 pins)
GND: Logic_controller (37 pins), Connection_of_encoders (10 pins)
I2C1_MUX_N_RESET: Logic_controller (U6.122), Connection_of_encoders (U2.3 U3.3 U4.3)
I2C1_SCL: Logic_controller (U6.136), Connection_of_encoders (R1.2 U2.22 U3.22 U4.22)
I2C1_SDA: Logic_controller (U6.137), Connection_of_encoders (R2.2 U2.23 U3.23 U4.23)
I2C2_MUX_N_RESET: Logic_controller (U6.12), ToF_sensors (U7.3)
I2C2_SCL: Logic_controller (U6.11), ToF_sensors (U7.22)
I2C2_SDA: Logic_controller (U6.10), ToF_sensors (U7.23)
XSHUT: Logic_controller (U6.13), ToF_sensors (6 pins)